# EAGLE schematic mainboard (EAGLE 9.3.0)
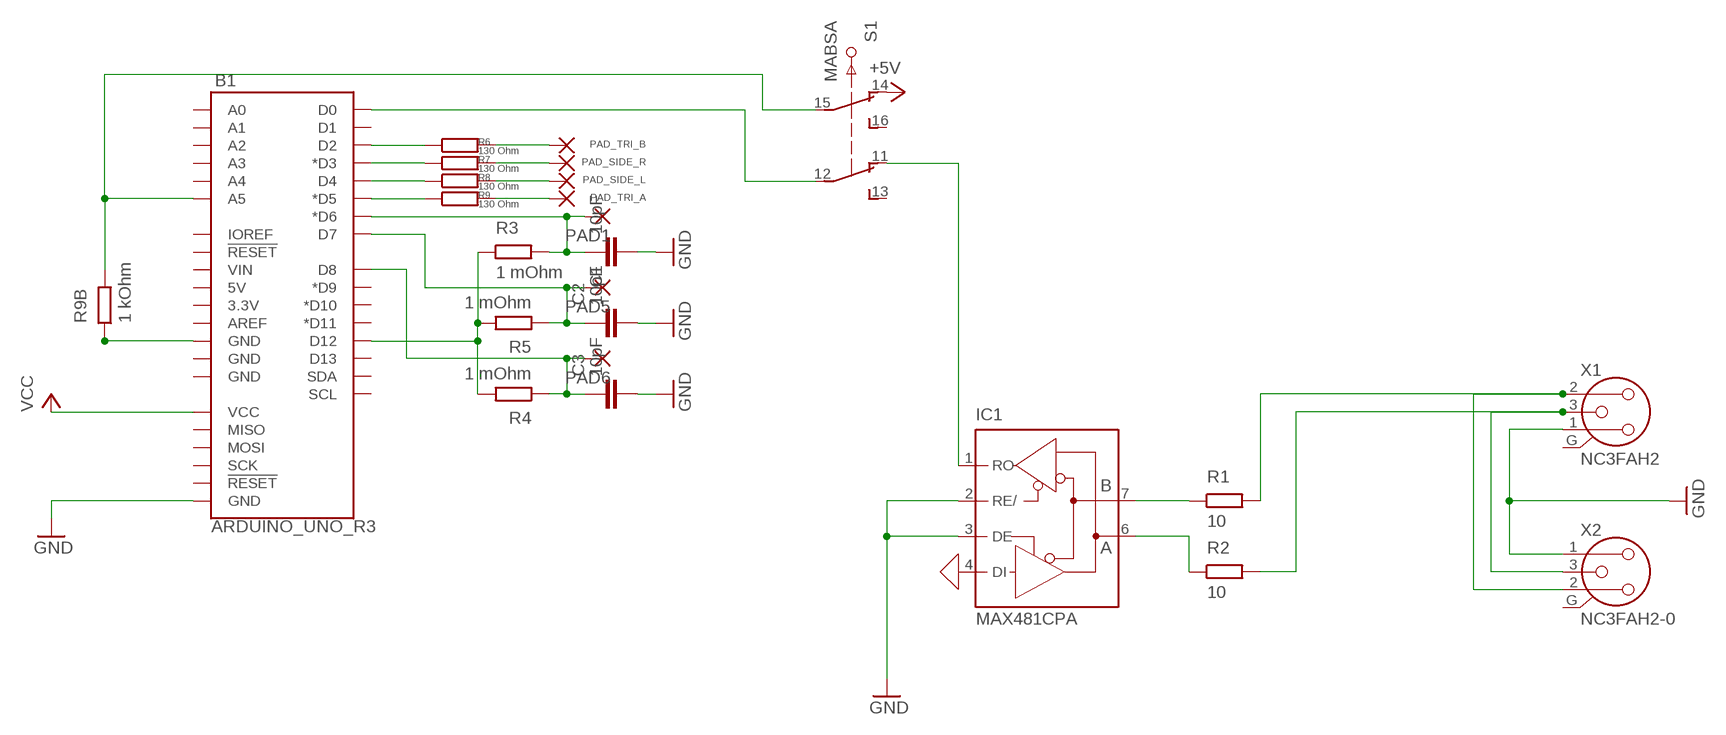
[diagram p0: schematic, sheet 1]

## Parts
B1  ARDUINO_UNO_R3  [ARDUINO_R3]
C1  10pF  C  (no package)
C2  10pF  C  (no package)
C3  10pF  C  (no package)
IC1  MAX481CPA  [DIL08]
PAD1  1,6/0,8  [1,6/0,8]
PAD5  1,6/0,8  [1,6/0,8]
PAD6  1,6/0,8  [1,6/0,8]
PAD_SIDE_L  1,6/0,8  [1,6/0,8]
PAD_SIDE_R  1,6/0,8  [1,6/0,8]
PAD_TRI_A  1,6/0,8  [1,6/0,8]
PAD_TRI_B  1,6/0,8  [1,6/0,8]
R1  10  R  (no package)
R2  10  R  (no package)
R3  1 mOhm  R  (no package)
R4  1 mOhm  R  (no package)
R5  1 mOhm  R  (no package)
R6  130 Ohm  R  (no package)
R7  130 Ohm  R  (no package)
R8  130 Ohm  R  (no package)
R9  130 Ohm  R  (no package)
R9B  1 kOhm  R  (no package)
S1  MABSA  [MABSA]
X1  NC3FAH2  [NC3FAH2]
X2  NC3FAH2-0  [NC3FAH2-0]

## Nets
0: IC1.4(DI) ; supply symbol labelled GND
+5V: S1.14
GND: B1.GND@1(GND) C1.2 C2.2 C3.2 IC1.2(RE/) IC1.3(DE) X1.1 X2.1
N$1: B1.D0 S1.12
N$2: R2.2 X1.3 X2.3
N$3: R1.2 X1.2 X2.2
N$4: IC1.7(B) R1.1
N$5: IC1.6(A) R2.1
N$6: IC1.1(RO) S1.11
N$7: B1.D6(*D6) C1.1 PAD1.1(P) R3.2
N$8: B1.D7 C2.1 PAD5.1(P) R5.1
N$9: B1.D8 C3.1 PAD6.1(P) R4.1
N$10: B1.D12 R3.1 R4.2 R5.2
N$11: B1.D2 R6.1
N$12: B1.D3(*D3) R7.1
N$13: B1.D4 R8.1
N$14: PAD_TRI_B.1(P) R6.2
N$15: PAD_SIDE_R.1(P) R7.2
N$16: PAD_SIDE_L.1(P) R8.2
N$17: B1.A5 R9B.2 S1.15
N$18: B1.GND@4(GND) R9B.1
N$19: B1.D5(*D5) R9.1
N$20: PAD_TRI_A.1(P) R9.2
VCC: B1.VCC
Unconnected: B1.3.3V B1.5V B1.A0 B1.A1 B1.A2 B1.A3 B1.A4 B1.AREF B1.D1 B1.D9(*D9) B1.D10(*D10) B1.D11(*D11) B1.D13 B1.GND@2(GND) B1.GND@3(GND) B1.IOREF B1.MISO B1.MOSI B1.RESET@1(!RESET!) B1.RESET@2(!RESET!) B1.SCK B1.SCL B1.SDA B1.VIN S1.13 S1.16 X1.G X2.G

## Power pins joined to a net without a drawn wire
GND: IC1.5(GND)
VCC: IC1.8(VCC)

## Library data of the parts
B1 = SparkFun-Boards:ARDUINO_UNO_R3: Arduino R3 Footprint with SPI header Arduino Uno R3 Compatible Footprint. Matches PCB size of the original board. SparkFun Products: SAMD21 Dev Breakout <https://www.sparkfun.com/products/13672> RedBoard <https://www.sparkfun.com/products/12757> R3 Stackable Headers <https://www.sparkfun.com/products/11417>
C1-C3 = ngspice-simulation:C: CAPACITOR
IC1 = maxim:MAX481CPA: RS485 TRANSEIVER; MPN: MAX481CPA+; OC_FARNELL: unknown; OC_NEWARK: 99K3445
PAD1 PAD5 PAD6 PAD_SIDE_L PAD_SIDE_R PAD_TRI_A PAD_TRI_B = wirepad:1,6/0,8: THROUGH-HOLE PAD
R1-R9 R9B = ngspice-simulation:R: RESISTOR
S1 = con-hirschmann:MABSA: Dual SWITCH; OC_FARNELL: unknown; OC_NEWARK: unknown
X1 = con-neutrik_ag:NC3: Neutrik Audio Connector XLR SERIES Stereo 1/4" jack Source: www.neutrik.com/; MPN: NC3FAH2; OC_FARNELL: unknown; OC_NEWARK: 27B4208
X2 = con-neutrik_ag:NC3: Neutrik Audio Connector XLR SERIES Stereo 1/4" jack Source: www.neutrik.com/; MPN: NC3FAH-2-0; OC_FARNELL: unknown; OC_NEWARK: 11J5829